# EAGLE design FRAM with level converter (integrated) (EAGLE 6.5.0)
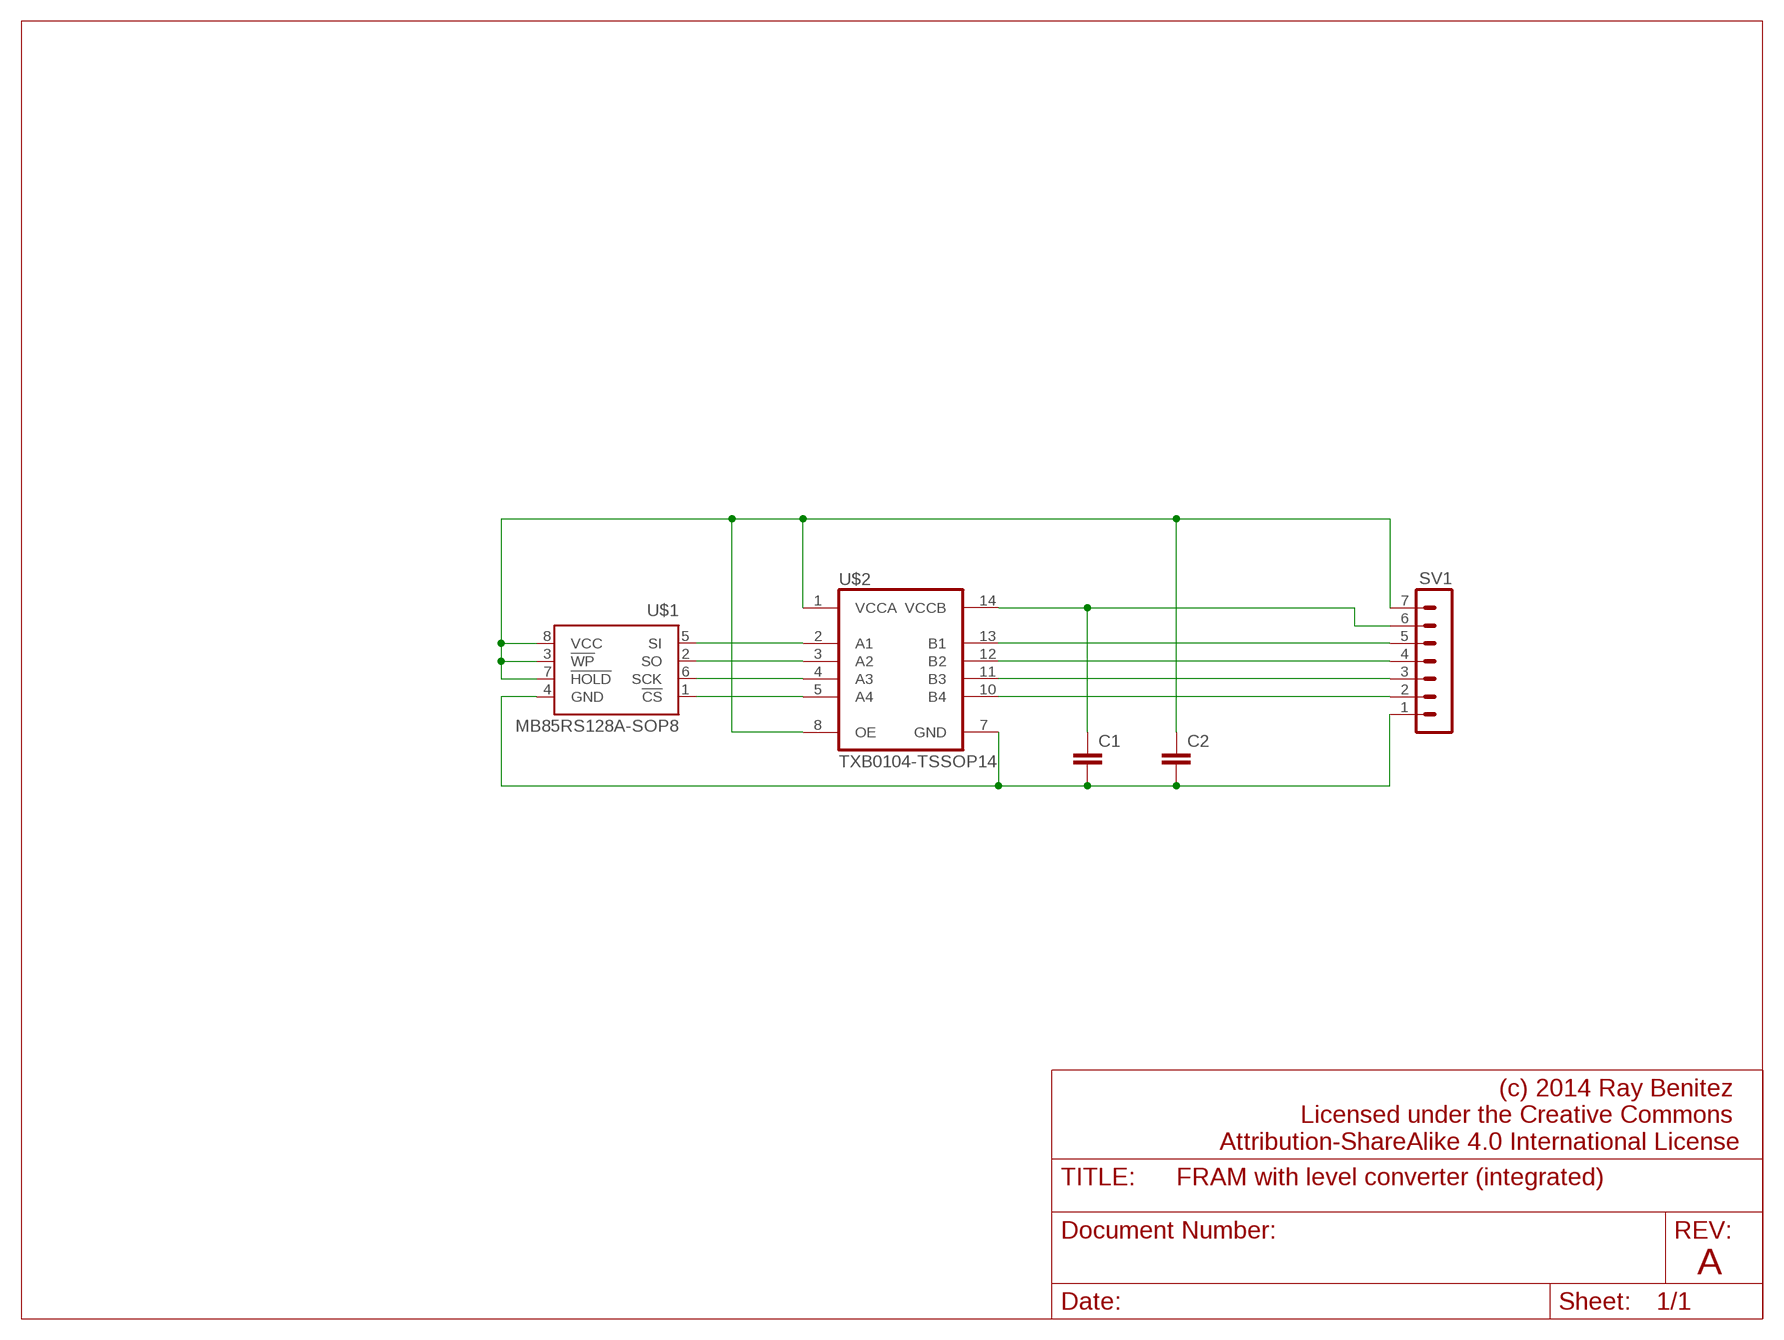
[diagram p0: schematic, sheet 1]

## Parts
C1  C-EUC0805  [C0805]
C2  C-EUC0805  [C0805]
SV1  MA07-1  [MA07-1]
U$1  MB85RS128A-SOP8  [SO08]
U$2  TXB0104-TSSOP14  [TSSOP14]

## Nets
GND: C1.2 C2.2 SV1.1 U$1.4(GND) U$2.7(GND)
N$1: SV1.5 U$2.13(B1)
N$2: SV1.4 U$2.12(B2)
N$3: U$1.5(SI) U$2.2(A1)
N$4: U$1.2(SO) U$2.3(A2)
N$5: C2.1 SV1.7 U$1.3(!WP) U$1.7(!HOLD) U$1.8(VCC) U$2.1(VCCA) U$2.8(OE)
N$6: SV1.2 U$2.10(B4)
N$7: SV1.3 U$2.11(B3)
N$8: U$1.6(SCK) U$2.4(A3)
N$9: U$1.1(!CS) U$2.5(A4)
N$11: C1.1 SV1.6 U$2.14(VCCB)

## Notes on the sheet
- (c) 2014 Ray Benitez 
  Licensed under the Creative Commons 
  Attribution-ShareAlike 4.0 International License
- A

## Library data of the parts
C1 C2 = resistor:C-EU: CAPACITOR, European symbol
SV1 = con-lstb:MA07-1: PIN HEADER; OC_FARNELL: unknown; OC_NEWARK: unknown
U$1 = hackscribble:MB85RS: Fujitsu MB85RS Ferroelectric RAM (FRAM) From http://www.fujitsu.com/global/services/microelectronics/product/memory/fram/standalone/
U$2 = hackscribble:TXB0104: 4-Bit Bidirectional Voltage-Level Translator With Automatic Direction Sensing From http://www.ti.com/product/txb0104

## Board
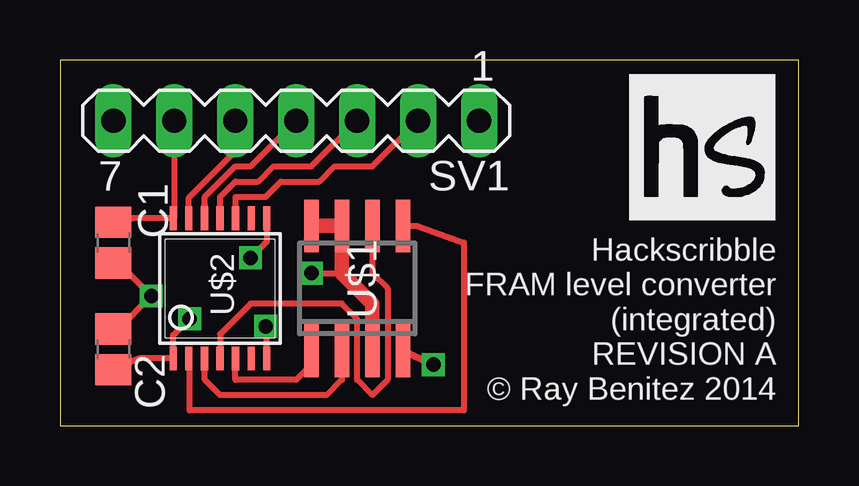
[diagram p1: board, top side]
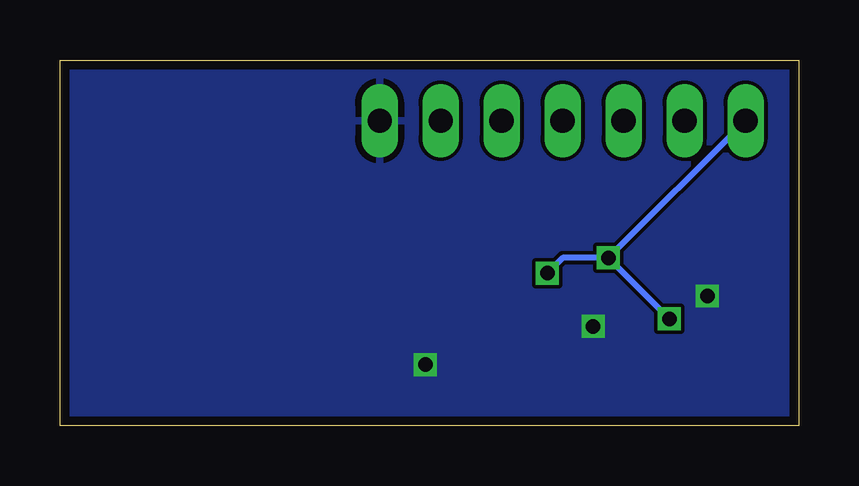
[diagram p2: board, bottom side, seen from below]

Size 30.79 x 15.23 mm. Coordinates in mm from the lower left corner, seen from the top.
Outline: 0,0 30.79,0 30.79,15.23 0,15.23 0,0
Copper layers (1*16): Top 0.0356mm / dielectric 1.5011mm / Bottom 0.0356mm
Design rules "LaenPCBOrder": minimum track width 6mil, minimum drill 13mil, track to track 6mil, track to pad 6mil, pad to pad 6mil, via to via 6mil, smd to smd 6mil, copper to edge 15mil, drill to drill 6mil, minimum pad ring 7mil, minimum via ring 7mil, stop-mask expansion 3mil, vias tented up to drill 0mil, thermal gap 10mil

### Footprints (pad centres in the part's own frame; a part is rotated, then mirrored left to right if it is on the bottom)
C0805 = smd 1.3 x 1.5: 1 -0.85,0; 2 0.85,0
MA07-1 = drill 1.016 long: 1 -7.62,0; 2 -5.08,0; 3 -2.54,0; 4 0,0; 5 2.54,0; 6 5.08,0; 7 7.62,0
SO08 = smd 0.6 x 2.2: 1 -1.905,-2.6; 2 -0.635,-2.6; 3 0.635,-2.6; 4 1.905,-2.6; 5 1.905,2.6; 6 0.635,2.6; 7 -0.635,2.6; 8 -1.905,2.6
TSSOP14 = smd 0.305 x 0.991: 1 -1.95,-2.918; 2 -1.3,-2.918; 3 -0.65,-2.918; 4 0,-2.918; 5 0.65,-2.918; 6 1.3,-2.918; 7 1.95,-2.918; 8 1.95,2.918; 9 1.3,2.918; 10 0.65,2.918; 11 0,2.918; 12 -0.65,2.918; 13 -1.3,2.918; 14 -1.95,2.918

### Placement (x,y rotation side)
C1  2.22,7.62 270 top
C2  2.22,3.17 90 top
SV1  9.84,12.7 180 top
U$1  12.38,5.71 0 top
U$2  6.67,5.71 0 top

### Tracks (layer width: path | path; a pad name or v marks a point on that pad's centre or on a via)
GND  (via drill 0.6)
  Top 0.254: U$2.7 8.62,4.08 v8.57,4.13 | C1.2 2.44,6.77 v3.81,5.4 2.44,4.02 C2.2
  Top 0.305: U$1.4 v15.56,2.54
  pour Bottom: 0,15.24 0,0 30.8,0 30.8,15.24
N$1
  Top 0.254: U$2.13 5.37,9.49 7.3,11.43 SV1.5
N$2
  Top 0.254: U$2.12 6.02,9.19 6.03,9.21 6.03,9.52 7.3,10.79 7.94,10.79 SV1.4
N$3
  Top 0.254: U$1.5 14.86,8.31 16.83,7.62 16.83,0.63 5.4,0.63 5.4,2.77 U$2.2
N$4
  Top 0.254: U$1.2 11.75,1.91 11.11,1.27 6.67,1.27 6.03,1.91 6.03,2.78 U$2.3
N$5  (via drill 0.6)
  Top 0.254: U$2.1 3.33,2.8 C2.1 | U$2.1 4.72,2.49 | U$2.8 8.62,7.66 v7.94,6.98 | v10.48,6.35 11.75,6.35 | U$2.1 4.72,3.77 v5.4,4.45
  Top 0.61: U$1.8 U$1.7 11.75,6.35 13.02,5.08 U$1.3
  Bottom 0.254: v7.94,6.98 9.84,6.98 v10.48,6.35 | v7.94,6.98 v5.4,4.45 | SV1.7 v7.94,6.98
N$6
  Top 0.254: U$2.10 7.32,9.51 7.3,9.52 8.57,9.52 9.21,10.16 10.8,10.16 11.43,10.79 13.02,10.79 SV1.2
N$7
  Top 0.254: U$2.11 6.67,9.52 7.3,10.16 8.26,10.16 8.89,10.79 10.48,10.79 SV1.3
N$8
  Top 0.254: U$1.6 13.02,6.35 13.65,5.71 13.65,1.91 13.02,1.27 12.38,1.91 12.38,4.45 11.75,5.08 7.94,5.08 6.67,3.81 U$2.4
N$9
  Top 0.254: U$1.1 10.48,2.54 9.84,1.91 7.3,1.91 7.3,2.78 U$2.5
N$11
  Top 0.254: C1.1 3.02,8.63 U$2.14 4.76,8.68 SV1.6

### Text on the board
tNames: Hackscribble / FRAM level converter / (integrated) / REVISION A / © Ray Benitez 2014